# Altium schematic sheet TopLevel.SchDoc
size A
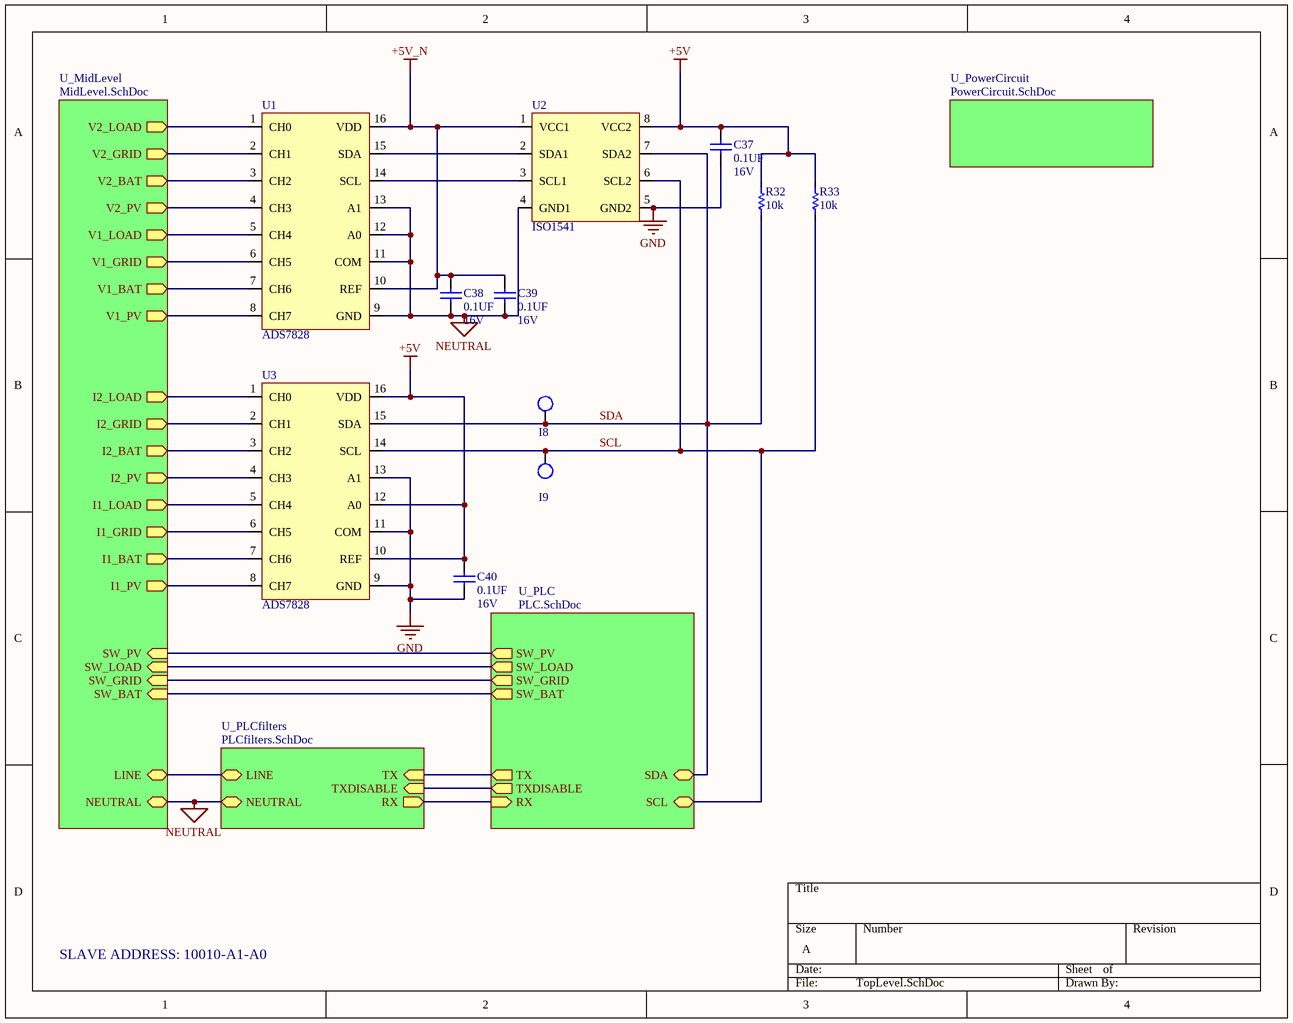
[diagram p0: TopLevel.SchDoc]

## Parts
C37  Capacitance: 0.1UF  Voltage - Rated: 16V  [CAPC1608X08N]  (hidden comment: GRM188R71C104KA01D)
C38  Capacitance: 0.1UF  Voltage - Rated: 16V  [CAPC1608X08N]  (hidden comment: GRM188R71C104KA01D)
C39  Capacitance: 0.1UF  Voltage - Rated: 16V  [CAPC1608X08N]  (hidden comment: GRM188R71C104KA01D)
C40  Capacitance: 0.1UF  Voltage - Rated: 16V  [CAPC1608X08N]  (hidden comment: GRM188R71C104KA01D)
I8  Testpoint  [Testpoint]  (value not drawn)
I9  Testpoint  [Testpoint]  (value not drawn)
R32  Resistance: 10k  [RESC1608X06N]  (hidden comment: RC0603FR-0710KL)
R33  Resistance: 10k  [RESC1608X06N]  (hidden comment: RC0603FR-0710KL)
U1  ADS7828  [TSOP65P640X120-16N]
U2  ISO1541  [SOIC127P600X175-8N]
U3  ADS7828  [TSOP65P640X120-16N]

## Sub-sheets
U_MidLevel = MidLevel.SchDoc: V1_PV (out), V2_PV (out), I1_PV (out), I2_PV (out), SW_PV (in), V1_LOAD (out), V2_LOAD (out), I1_LOAD (out), I2_LOAD (out), SW_LOAD (in), V1_GRID (out), V2_GRID (out), I1_GRID (out), I2_GRID (out), SW_GRID (in), V1_BAT (out), V2_BAT (out), I1_BAT (out), I2_BAT (out), SW_BAT (in), NEUTRAL (bidir), LINE (bidir)
U_PLC = PLC.SchDoc: TX (out), RX (in), TXDISABLE (out), SCL (bidir), SDA (bidir), SW_PV (out), SW_LOAD (out), SW_GRID (out), SW_BAT (out)
U_PLCfilters = PLCfilters.SchDoc: RX (out), TX (in), TXDISABLE (in), LINE (bidir), NEUTRAL (bidir)
U_PowerCircuit = PowerCircuit.SchDoc: no entries

## Nets
+5V: C37.2 C40.2 R32.2 R33.2 U2.8(VCC2) U3.10(REF) U3.12(A0) U3.16(VDD)
+5V_N: C38.2 C39.2 U1.10(REF) U1.16(VDD) U2.1(VCC1)
GND: C37.1 C40.1 U2.5(GND2) U3.9(GND) U3.11(COM) U3.13(A1)
NEUTRAL: C38.1 C39.1 U1.9(GND) U1.11(COM) U1.12(A0) U1.13(A1) U2.4(GND1) ; sheet U_MidLevel/NEUTRAL, sheet U_PLCfilters/NEUTRAL
SCL: I9.1(TP) R33.1 U2.6(SCL2) U3.14(SCL) ; sheet U_PLC/SCL
SDA: I8.1(TP) R32.1 U2.7(SDA2) U3.15(SDA) ; sheet U_PLC/SDA
NetU1_1: U1.1(CH0) ; sheet U_MidLevel/V2_LOAD
NetU1_2: U1.2(CH1) ; sheet U_MidLevel/V2_GRID
NetU1_3: U1.3(CH2) ; sheet U_MidLevel/V2_BAT
NetU1_4: U1.4(CH3) ; sheet U_MidLevel/V2_PV
NetU1_5: U1.5(CH4) ; sheet U_MidLevel/V1_LOAD
NetU1_6: U1.6(CH5) ; sheet U_MidLevel/V1_GRID
NetU1_7: U1.7(CH6) ; sheet U_MidLevel/V1_BAT
NetU1_8: U1.8(CH7) ; sheet U_MidLevel/V1_PV
NetU1_14: U1.14(SCL) U2.3(SCL1)
NetU1_15: U1.15(SDA) U2.2(SDA1)
NetU3_1: U3.1(CH0) ; sheet U_MidLevel/I2_LOAD
NetU3_2: U3.2(CH1) ; sheet U_MidLevel/I2_GRID
NetU3_3: U3.3(CH2) ; sheet U_MidLevel/I2_BAT
NetU3_4: U3.4(CH3) ; sheet U_MidLevel/I2_PV
NetU3_5: U3.5(CH4) ; sheet U_MidLevel/I1_LOAD
NetU3_6: U3.6(CH5) ; sheet U_MidLevel/I1_GRID
NetU3_7: U3.7(CH6) ; sheet U_MidLevel/I1_BAT
NetU3_8: U3.8(CH7) ; sheet U_MidLevel/I1_PV
(unnamed): sheet U_MidLevel/SW_PV, sheet U_PLC/SW_PV
(unnamed): sheet U_MidLevel/SW_LOAD, sheet U_PLC/SW_LOAD
(unnamed): sheet U_MidLevel/SW_GRID, sheet U_PLC/SW_GRID
(unnamed): sheet U_MidLevel/SW_BAT, sheet U_PLC/SW_BAT
(unnamed): sheet U_MidLevel/LINE, sheet U_PLCfilters/LINE
(unnamed): sheet U_PLCfilters/RX, sheet U_PLC/RX
(unnamed): sheet U_PLCfilters/TX, sheet U_PLC/TX
(unnamed): sheet U_PLCfilters/TXDISABLE, sheet U_PLC/TXDISABLE

## Notes on the sheet
- SLAVE ADDRESS: 10010-A1-A0

## Library data of the parts
C37-C40 = GRM188R71C104KA01D: CAP CER 0.1UF 16V X7R 0603; Manufacturer: Murata Electronics North America; Manufacturer Part Number: GRM188R71C104KA01D; Supplier 1: Digi-Key; Supplier Part Number 1: 490-1532-1-ND
R32 R33 = RC0603FR-0710KL: RES SMD 10K OHM 1% 1/10W 0603; Manufacturer: Yageo; Manufacturer Part Number: RC0603FR-0710KL; Supplier 1: Digi-Key; Supplier Part Number 1: 311-10.0KHRCT-ND
U1 U3 = ADS7828: IC ADC 12BIT 50KSPS 8CH 16-TSSOP; Manufacturer: Texas Instruments; Manufacturer Part Number: ADS7828; Supplier 1: Digi-Key; Supplier Part Number 1: 296-38856-1-ND
U2 = ISO1541: DGTL ISO 2.5KV 2CH I2C 8SOIC; Manufacturer: Texas Instruments; Manufacturer Part Number: ISO1541; Supplier 1: Digi-Key; Supplier Part Number 1: 296-34895-5-ND